# EasyEDA schematic VX1010.json
TITLE: VISION X1010; REV: 1.0; Date: 2023-04-13; Sheet: 1/1; Drawn By: UnethicalBear; Company: Your Company
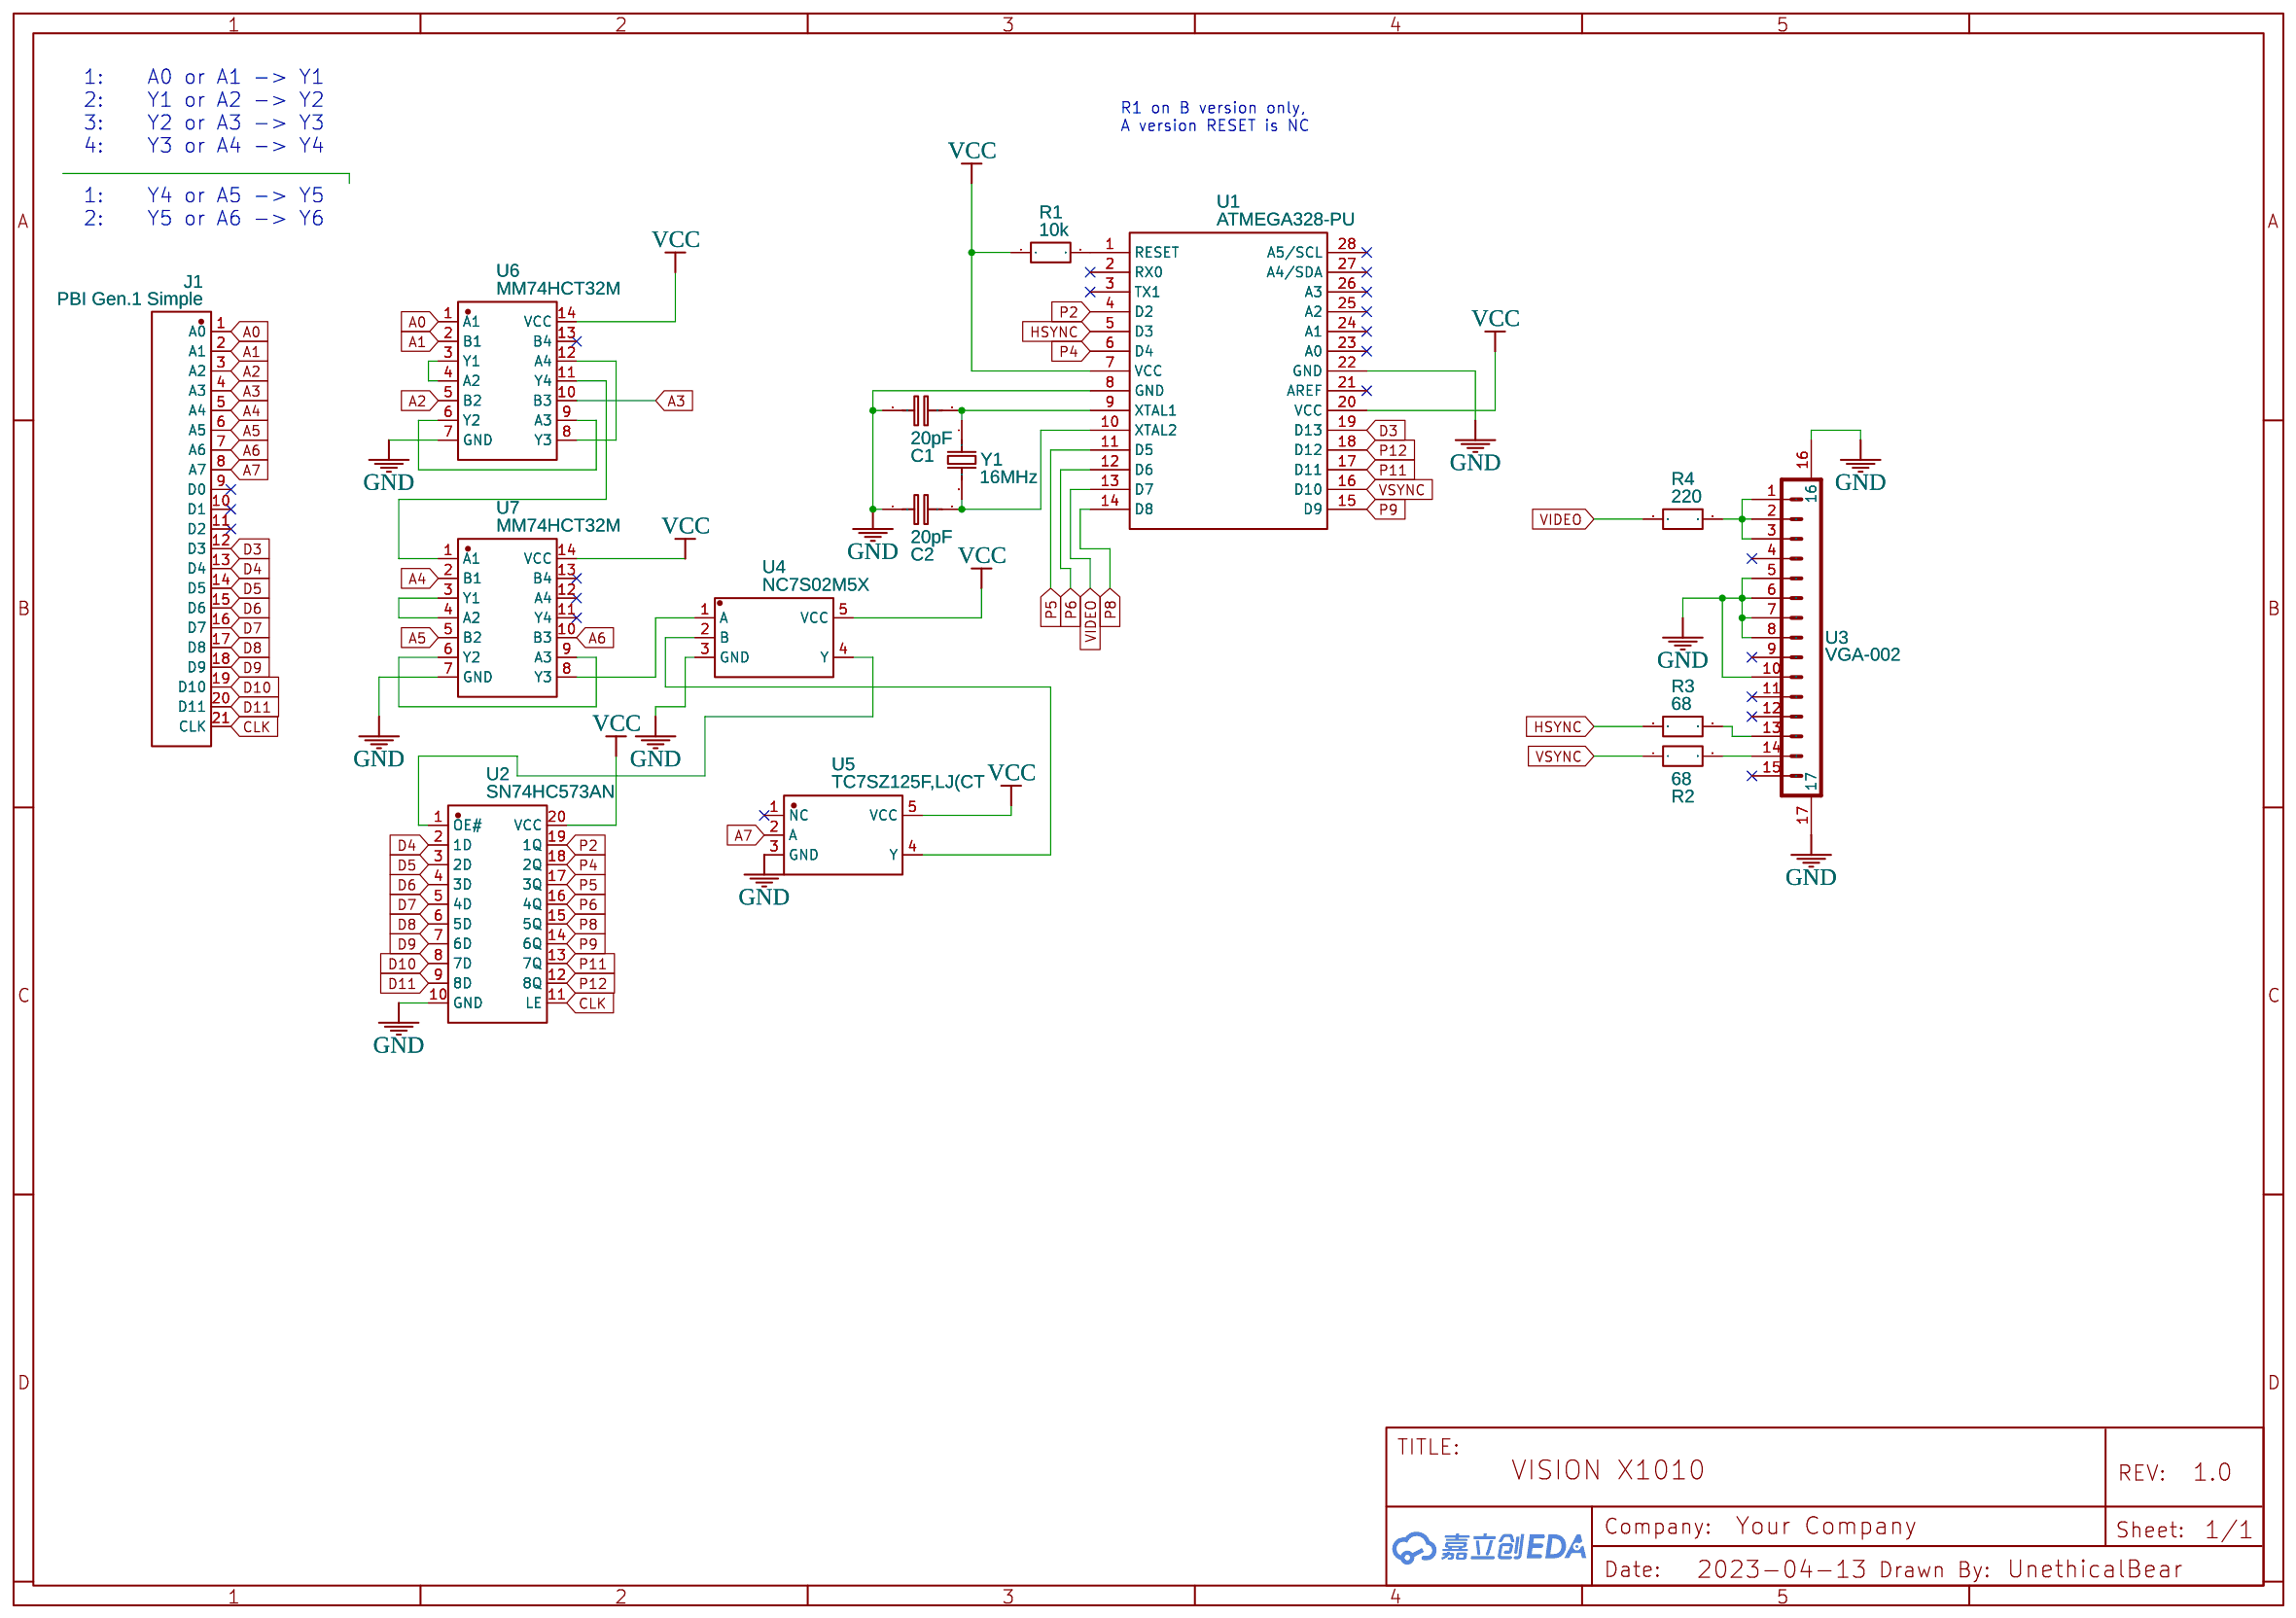
[diagram p0: schematic sheet]

## Parts
C1  20pF  [RAD-0.1]
C2  20pF  [RAD-0.1]
J1  PBI Gen.1 Simple
R1  10k  [R_AXIAL-0.3]
R2  68  [R_AXIAL-0.3]
R3  68  [R_AXIAL-0.3]
R4  220  [R_AXIAL-0.3]
U1  ATMEGA328-PU  [ATMEGA328-PU]
U2  SN74HC573AN  [DIP-20_L26.8-W6.4-P2.54-LS7.6-BL]
U3  VGA-002  [D-SUB-TH_VGA-002]
U4  NC7S02M5X  [SOT-23-5_L3.0-W1.7-P0.95-LS2.8-BL]
U5  TC7SZ125F,LJ(CT  [SOT-23-5_L3.0-W1.7-P0.95-LS2.8-BL]
U6  MM74HCT32M  [SOIC-14_L8.7-W3.9-P1.27-LS6.0-BL]
U7  MM74HCT32M  [SOIC-14_L8.7-W3.9-P1.27-LS6.0-BL]
Y1  16MHz  [HC-49S]

## Library data of the parts
C1 C2 = C_RAD-0.1_EU: Contributor: LCEDA_Lib
J1 = PBI Gen.1 Simple
R1-R4 = R_AXIAL-0.3_EU: Contributor: LCEDA_Lib
U1 = ATMEGA328-PU 28 PINSET: Contributor: Sopian; sourceId: 3rfdaKkiS
U2 = SN74HC573AN: Supplier: LCSC; Manufacturer: TI; image: //image.lceda.cn/szlcsc/C5196.jpg; Supplier Part: C5196; Contributor: Rubber_BeQi
U3 = VGA-002: Supplier: LCSC; Manufacturer: BOOMELE(博穆精密); Supplier Part: C138387; JLCPCB Part Class: Extended Part
U4 = NC7S02M5X: Supplier: LCSC; Supplier Part: C112083; Manufacturer: onsemi(安森美); Contributor: LCSC; JLCPCB Part Class: Extended Part
U5 = TC7SZ125F,LJ(CT: Supplier: LCSC; Supplier Part: C2675515; Manufacturer: TOSHIBA(东芝); Contributor: LCSC; JLCPCB Part Class: Extended Part
U6 U7 = MM74HCT32M: Supplier: LCSC; Supplier Part: C897305; Manufacturer: onsemi(安森美); Contributor: LCSC; JLCPCB Part Class: Extended Part
Y1 = X49SSM16MSD2SI: Supplier: Mouser; Manufacturer: ABRACON; Manufacturer Part: ABL-16.000MHZ-B2; Supplier Part: 815-ABL-16-B2; Contributor: abduladam

## Nets
GND: C1.1 C2.1 U1.8(GND) U1.22(GND) U2.10(GND) U3.5 U3.6 U3.7 U3.8 U3.10 U3.16 U3.17 U4.3(GND) U5.3(GND) U6.7(GND) U7.7(GND)
VCC: R1.1 U1.7(VCC) U1.20(VCC) U2.20(VCC) U4.5(VCC) U5.5(VCC) U6.14(VCC) U7.14(VCC)
A0: J1.1(A0) U6.1(A1)
A1: J1.2(A1) U6.2(B1)
A2: J1.3(A2) U6.5(B2)
A3: J1.4(A3) U6.10(B3)
A4: J1.5(A4) U7.2(B1)
A5: J1.6(A5) U7.5(B2)
A6: J1.7(A6) U7.10(B3)
A7: J1.8(A7) U5.2(A)
CLK: J1.21(CLK) U2.11(LE)
D3: J1.12(D3) U1.19(D13)
D4: J1.13(D4) U2.2(1D)
D5: J1.14(D5) U2.3(2D)
D6: J1.15(D6) U2.4(3D)
D7: J1.16(D7) U2.5(4D)
D8: J1.17(D8) U2.6(5D)
D9: J1.18(D9) U2.7(6D)
D10: J1.19(D10) U2.8(7D)
D11: J1.20(D11) U2.9(8D)
HSYNC: R3.1 U1.5(D3)
P2: U1.4(D2) U2.19(1Q)
P4: U1.6(D4) U2.18(2Q)
P5: U1.11(D5) U2.17(3Q)
P6: U1.12(D6) U2.16(4Q)
P8: U1.14(D8) U2.15(5Q)
P9: U1.15(D9) U2.14(6Q)
P11: U1.17(D11) U2.13(7Q)
P12: U1.18(D12) U2.12(8Q)
VIDEO: R4.1 U1.13(D7)
VSYNC: R2.1 U1.16(D10)
Net-(C1-2): C1.2 U1.9(XTAL1) Y1.1
Net-(C2-2): C2.2 U1.10(XTAL2) Y1.2
Net-(R1-2): R1.2 U1.1(RESET)
Net-(R2-2): R2.2 U3.14
Net-(R3-2): R3.2 U3.13
Net-(R4-2): R4.2 U3.1 U3.2 U3.3
Net-(U2-1): U2.1(OE#) U4.4(Y)
Net-(U4-1): U4.1(A) U7.8(Y3)
Net-(U4-2): U4.2(B) U5.4(Y)
Net-(U6-3): U6.3(Y1) U6.4(A2)
Net-(U6-6): U6.6(Y2) U6.9(A3)
Net-(U6-8): U6.8(Y3) U6.12(A4)
Net-(U6-11): U6.11(Y4) U7.1(A1)
Net-(U7-3): U7.3(Y1) U7.4(A2)
Net-(U7-6): U7.6(Y2) U7.9(A3)

Not connected (* = marked no-connect by the designer): J1 9(D0)* 10(D1)* 11(D2)*; U1 2(RX0)* 3(TX1)* 21(AREF)* 23(A0)* 24(A1)* 25(A2)* 26(A3)* 27(A4/SDA)* 28(A5/SCL)*; U3 4* 9* 11* 12* 15*; U5 1(NC)*; U6 13(B4)*; U7 11(Y4)* 12(A4)* 13(B4)*

## Notes on the sheet
- 1:    A0 or A1 -> Y1
  2:    Y1 or A2 -> Y2
  3:    Y2 or A3 -> Y3
  4:    Y3 or A4 -> Y4
- R1 on B version only,
  A version RESET is NC
- 1:    Y4 or A5 -> Y5
  2:    Y5 or A6 -> Y6
